# EAGLE design atcan (EAGLE 4.16)
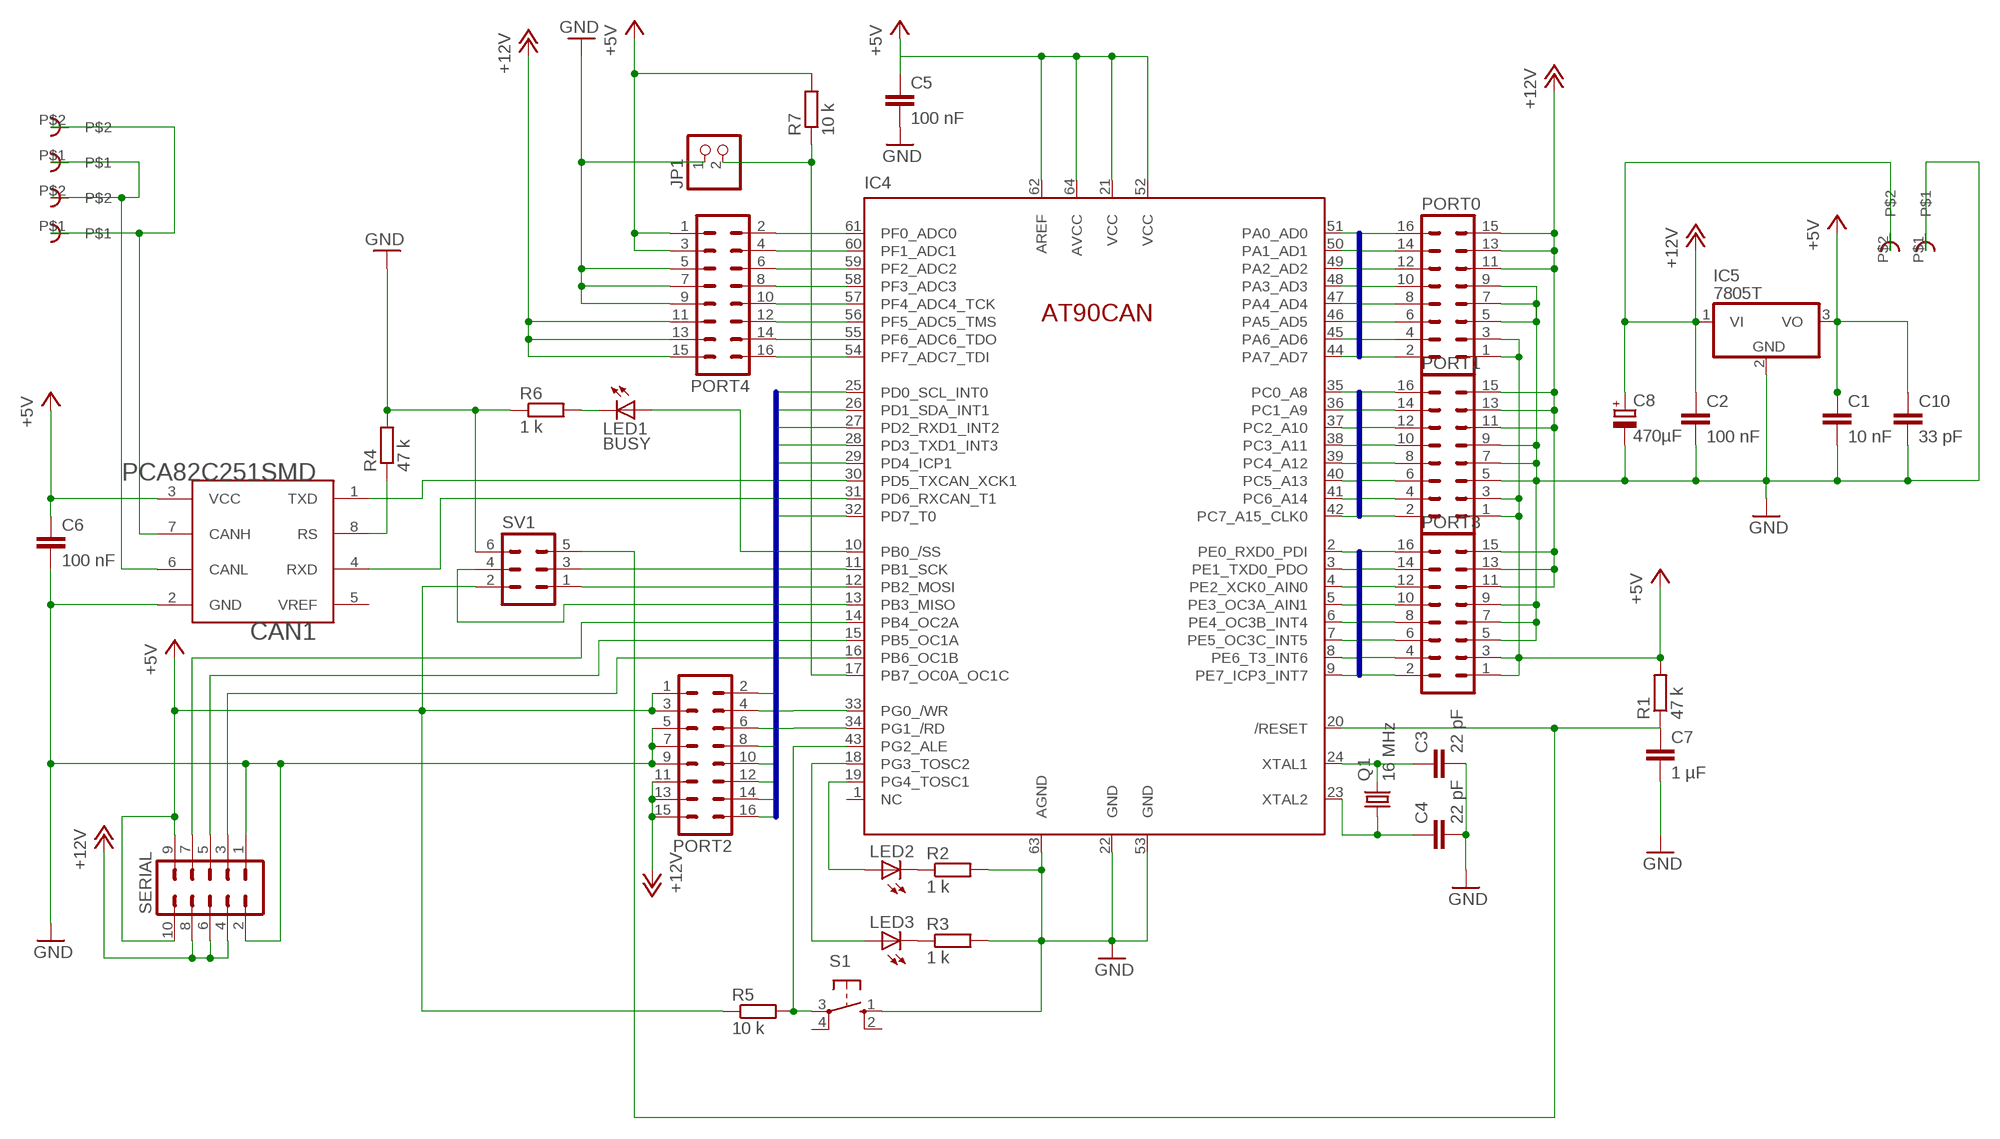
[diagram p0: schematic, sheet 1]

## Parts
C1  10 nF  C-EUC1206  [C1206]
C2  100 nF  C-EUC1206  [C1206]
C3  22 pF  C-EUC1206  [C1206]
C4  22 pF  C-EUC1206  [C1206]
C5  100 nF  C-EUC1206  [C1206]
C6  100 nF  C-EUC1206  [C1206]
C7  1 µF  C-EUC1206  [C1206]
C8  470µF  CPOL-EUR/2012-12R  [R/2012-12R]
C10  33 pF  C-EUC1206  [C1206]
CAN1  PCA82C251SMD  [SO8]
CAN-1  RIACON101-2  [RIACON101-2]
CAN-2  RIACON101-2  [RIACON101-2]
IC4  AT90CAN-TQFP  [TQFP64]
IC5  7805T  [TO220H]
JP1  PINHD-1X2  [1X02]
LED1  BUSY  LEDCHIPLED_1206  [CHIPLED_1206]
LED2  LEDCHIPLED_1206  [CHIPLED_1206]
LED3  LEDCHIPLED_1206  [CHIPLED_1206]
PORT0  ML16  [ML16]
PORT1  ML16  [ML16]
PORT2  ML16  [ML16]
PORT3  ML16  [ML16]
PORT4  ML16  [ML16]
POWER  RIACON101-2  [RIACON101-2]
Q1  16 MHz  CRYSTALSM49  [SM49]
R1  47 k  R-EU_M1206  [M1206]
R2  1 k  R-EU_M1206  [M1206]
R3  1 k  R-EU_M1206  [M1206]
R4  47 k  R-EU_M1206  [M1206]
R5  10 k  R-EU_M1206  [M1206]
R6  1 k  R-EU_M1206  [M1206]
R7  10 k  R-EU_M1206  [M1206]
S1  10-XX  [B3F-10XX]
SERIAL  ML10  [ML10]
SV1  ML6  [ML6]

## Nets
+5V: C1.1 C5.1 C6.1 C10.1 CAN1.3(VCC) IC4.21(VCC) IC4.52(VCC) IC4.62(AREF) IC4.64(AVCC) IC5.3(VO) PORT0.1 PORT0.3 PORT1.1 PORT1.3 PORT2.1 PORT2.3 PORT3.1 PORT3.3 PORT4.1 PORT4.3 R1.2 R5.1 R7.2 SERIAL.9 SERIAL.10 SV1.2
+12V: C2.1 C8.+ IC5.1(VI) PORT0.11 PORT0.13 PORT0.15 PORT1.11 PORT1.13 PORT1.15 PORT2.11 PORT2.13 PORT2.15 PORT3.11 PORT3.13 PORT3.15 PORT4.11 PORT4.13 PORT4.15 POWER.P$2 SERIAL.4 SERIAL.6 SERIAL.8
CANH: CAN1.6(CANL) CAN-1.P$1 CAN-2.P$2
CANL: CAN1.7(CANH) CAN-1.P$2 CAN-2.P$1
GND: C1.2 C2.2 C3.2 C4.2 C5.2 C6.2 C7.2 C8.- C10.2 CAN1.2(GND) IC4.22(GND) IC4.53(GND) IC4.63(AGND) IC5.2(GND) JP1.1 PORT0.5 PORT0.7 PORT0.9 PORT1.5 PORT1.7 PORT1.9 PORT2.5 PORT2.7 PORT2.9 PORT3.5 PORT3.7 PORT3.9 PORT4.5 PORT4.7 PORT4.9 POWER.P$1 R2.2 R3.2 R4.2 R6.1 S1.1(S) SERIAL.1 SERIAL.2 SV1.6
N$1: IC4.61(PF0_ADC0) PORT4.2
N$2: CAN1.8(RS) R4.1
N$3: IC4.12(PB2_MOSI) SV1.1
N$4: IC4.13(PB3_MISO) SV1.4
N$5: IC4.11(PB1_SCK) SV1.3
N$6: CAN1.4(RXD) IC4.31(PD6_RXCAN_T1)
N$7: CAN1.1(TXD) IC4.30(PD5_TXCAN_XCK1)
N$8: C3.1 IC4.24(XTAL1) Q1.2
N$9: IC4.14(PB4_OC2A) SERIAL.7
N$10: C4.1 IC4.23(XTAL2) Q1.1
N$11: IC4.15(PB5_OC1A) SERIAL.5
N$12: IC4.16(PB6_OC1B) SERIAL.3
N$13: IC4.60(PF1_ADC1) PORT4.4
N$14: IC4.59(PF2_ADC2) PORT4.6
N$15: IC4.58(PF3_ADC3) PORT4.8
N$16: IC4.57(PF4_ADC4_TCK) PORT4.10
N$17: IC4.56(PF5_ADC5_TMS) PORT4.12
N$18: IC4.55(PF6_ADC6_TDO) PORT4.14
N$19: IC4.54(PF7_ADC7_TDI) PORT4.16
N$20: LED1.C R6.2
N$21: IC4.10(PB0_/SS) LED1.A
N$22: LED2.C R2.1
N$23: LED3.C R3.1
N$24: IC4.19(PG4_TOSC1) LED2.A
N$25: IC4.18(PG3_TOSC2) LED3.A
N$26: IC4.43(PG2_ALE) R5.2 S1.3(P)
N$28: IC4.17(PB7_OC0A_OC1C) JP1.2 R7.1
PORTA0: IC4.51(PA0_AD0) PORT0.2
PORTA1: IC4.50(PA1_AD1) PORT0.4
PORTA2: IC4.49(PA2_AD2) PORT0.6
PORTA3: IC4.48(PA3_AD3) PORT0.8
PORTA4: IC4.47(PA4_AD4) PORT0.10
PORTA5: IC4.46(PA5_AD5) PORT0.12
PORTA6: IC4.45(PA6_AD6) PORT0.14
PORTA7: IC4.44(PA7_AD7) PORT0.16
PORTC0: IC4.35(PC0_A8) PORT1.2
PORTC1: IC4.36(PC1_A9) PORT1.4
PORTC2: IC4.37(PC2_A10) PORT1.6
PORTC3: IC4.38(PC3_A11) PORT1.8
PORTC4: IC4.39(PC4_A12) PORT1.10
PORTC5: IC4.40(PC5_A13) PORT1.12
PORTC6: IC4.41(PC6_A14) PORT1.14
PORTC7: IC4.42(PC7_A15_CLK0) PORT1.16
PORTD0: IC4.25(PD0_SCL_INT0) PORT2.16
PORTD1: IC4.26(PD1_SDA_INT1) PORT2.14
PORTD2: IC4.27(PD2_RXD1_INT2) PORT2.12
PORTD3: IC4.28(PD3_TXD1_INT3) PORT2.10
PORTD4: IC4.29(PD4_ICP1) PORT2.8
PORTD5: IC4.32(PD7_T0) PORT2.6
PORTD6: IC4.33(PG0_/WR) PORT2.4
PORTD7: IC4.34(PG1_/RD) PORT2.2
PORTE0: IC4.2(PE0_RXD0_PDI) PORT3.2
PORTE1: IC4.3(PE1_TXD0_PDO) PORT3.4
PORTE2: IC4.4(PE2_XCK0_AIN0) PORT3.6
PORTE3: IC4.5(PE3_OC3A_AIN1) PORT3.8
PORTE4: IC4.6(PE4_OC3B_INT4) PORT3.10
PORTE5: IC4.7(PE5_OC3C_INT5) PORT3.12
PORTE6: IC4.8(PE6_T3_INT6) PORT3.14
PORTE7: IC4.9(PE7_ICP3_INT7) PORT3.16
RESET: C7.1 IC4.20(/RESET) R1.1 SV1.5
Unconnected: CAN1.5(VREF) IC4.1(NC) S1.2(S1) S1.4(P1)

## Buses
PORTA[0..7]
PORTC[0..7]
PORTE[0..7]
PORTD[0..7]

## Library data of the parts
C1-C7 C10 = rcl:C-EU: CAPACITOR, European symbol
C8 = rcl:CPOL-EU: POLARIZED CAPACITOR, European symbol
CAN1 = 82C250SMD:PCA82C251SMD
CAN-1 CAN-2 POWER = con-riacon101-v2:RIACON101-2: Riaconn Schreaubklemme 101
IC4 = controller-micro_atmel_jd:AT90CAN
IC5 = linear:78*: Positive VOLTAGE REGULATOR Source: http://cache.national.com/ds/LM/LM78L05.pdf http://www.fairchildsemi.com/ds/LM/LM7805.pdf
JP1 = pinhead:PINHD-1X2: PIN HEADER
LED1-LED3 = led:LED: LED OSRAM: - CHIPLED LG R971, LG N971, LY N971, LG Q971, LY Q971, LO R971, LY R971 LH N974, LH R974 LS Q976, LO Q976, LY Q976 LO Q996 - Hyper CHIPLED LW Q18S LB Q993, LB Q99A, LB R99A - SideLED LS A670, LO A670, LY A670, LG A670, LP A670 LB A673, LV A673, LT A673, LW A673 LH A674 LY A675 LS A676, LA A676, LO A676, LY A676, LW A676 LS A679, LY A679, LG A679 - Hyper Micro SIDELED® LS Y876, LA Y876, LO Y876, LY Y876 LT Y87S - SmartLED LW L88C, LW L88S LB L89C, LB L89S, LG L890 LS L89K, LO L89K, LY L89K LS L896, LA L896, LO L896, LY L896 - TOPLED LS T670, LO T670, LY T670, LG T670, LP T670 LSG T670, LSP T670, LSY T670, LOP T670, LYG T670 LG T671, LOG T671, LSG T671 LB T673, LV T673, LT T673, LW T673 LH T674 LS T676, LA T676, LO T676, LY T676, LB T676, LH T676, LSB T676, LW T676 LB T67C, LV T67C, LT T67C, LS T67K, LO T67K, LY T67K, LW E67C LS E67B, LA E67B, LO E67B, LY E67B, LB E67C, LV E67C, LT E67C LW T67C LS T679, LY T679, LG T679 LS T770, LO T770, LY T770, LG T770, LP T770 LB T773, LV T773, LT T773, LW T773 LH T774 LS E675, LA E675, LY E675, LS T675 LS T776, LA T776, LO T776, LY T776, LB T776 LHGB T686 LT T68C, LB T68C - Hyper Mini TOPLED® LB M676 - Mini TOPLED Santana® LG M470 LS M47K, LO M47K, LY M47K Source: http://www.osram.convergy.de - LUMILED® LXK2-PW12-R00, LXK2-PW12-S00, LXK2-PW14-U00, LXK2-PW14-V00 LXK2-PM12-R00, LXK2-PM12-S00, LXK2-PM14-U00 LXK2-PE12-Q00, LXK2-PE12-R00, LXK2-PE12-S00, LXK2-PE14-T00, LXK2-PE14-U00 LXK2-PB12-K00, LXK2-PB12-L00, LXK2-PB12-M00, LXK2-PB14-N00, LXK2-PB14-P00, LXK2-PB14-Q00 LXK2-PR12-L00, LXK2-PR12-M00, LXK2-PR14-Q00, LXK2-PR14-R00 LXK2-PD12-Q00, LXK2-PD12-R00, LXK2-PD12-S00 LXK2-PH12-R00, LXK2-PH12-S00 LXK2-PL12-P00, LXK2-PL12-Q00, LXK2-PL12-R00 Source: www.luxeon.com
PORT0 PORT1-PORT4 = con-harting-ml:ML16: HARTING
Q1 = crystal:CRYSTAL: CRYSTAL
R1-R7 = rcl:R-EU_: RESISTOR, European symbol
S1 = switch-omron:10-XX: OMRON SWITCH
SERIAL = con-harting-ml:ML10: HARTING
SV1 = con-harting-ml:ML6: HARTING

## Board
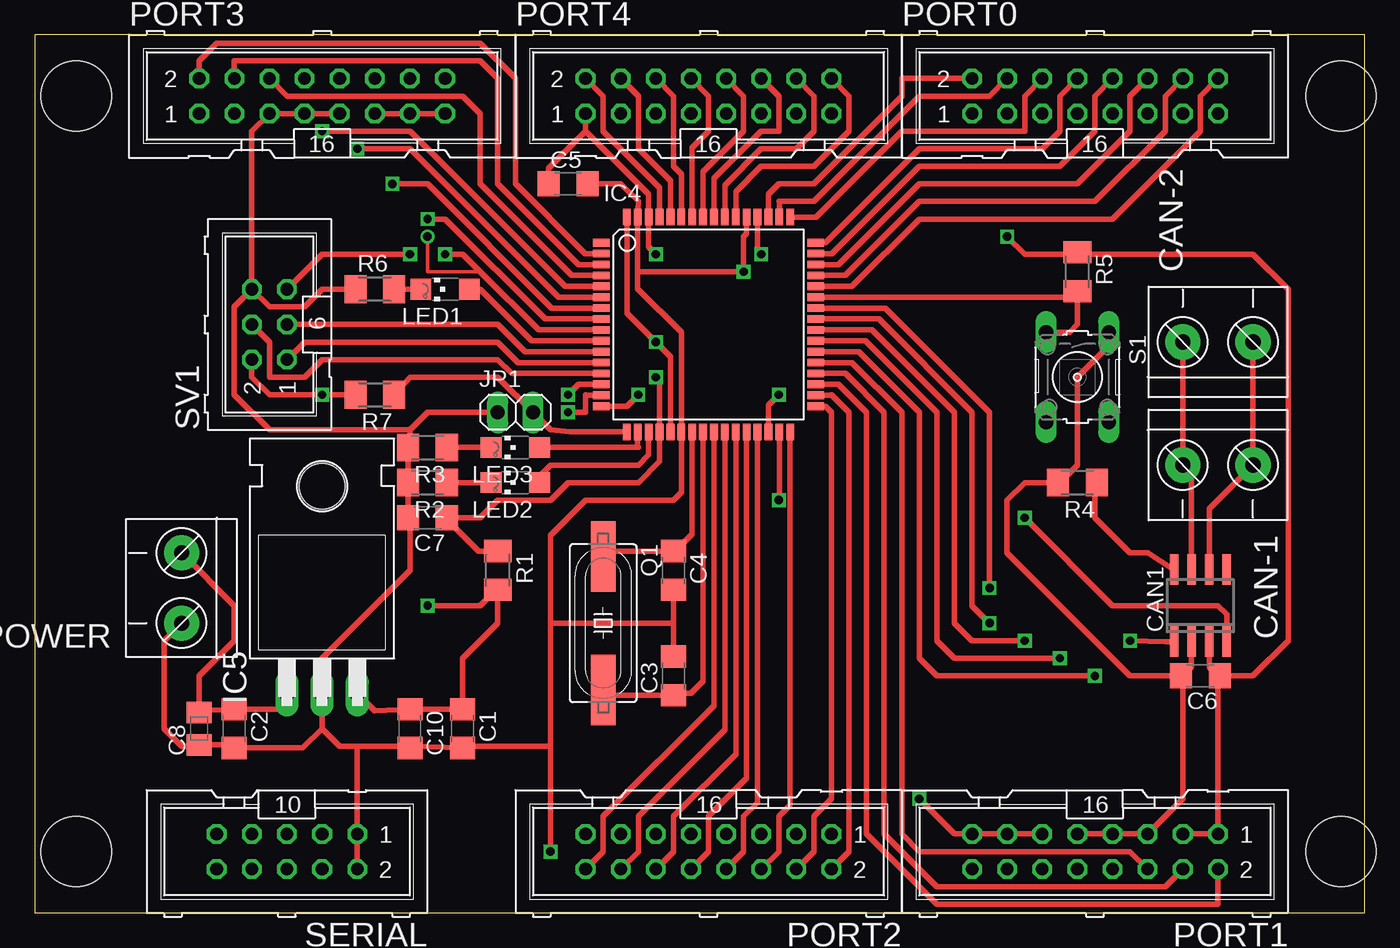
[diagram p1: board, top side]
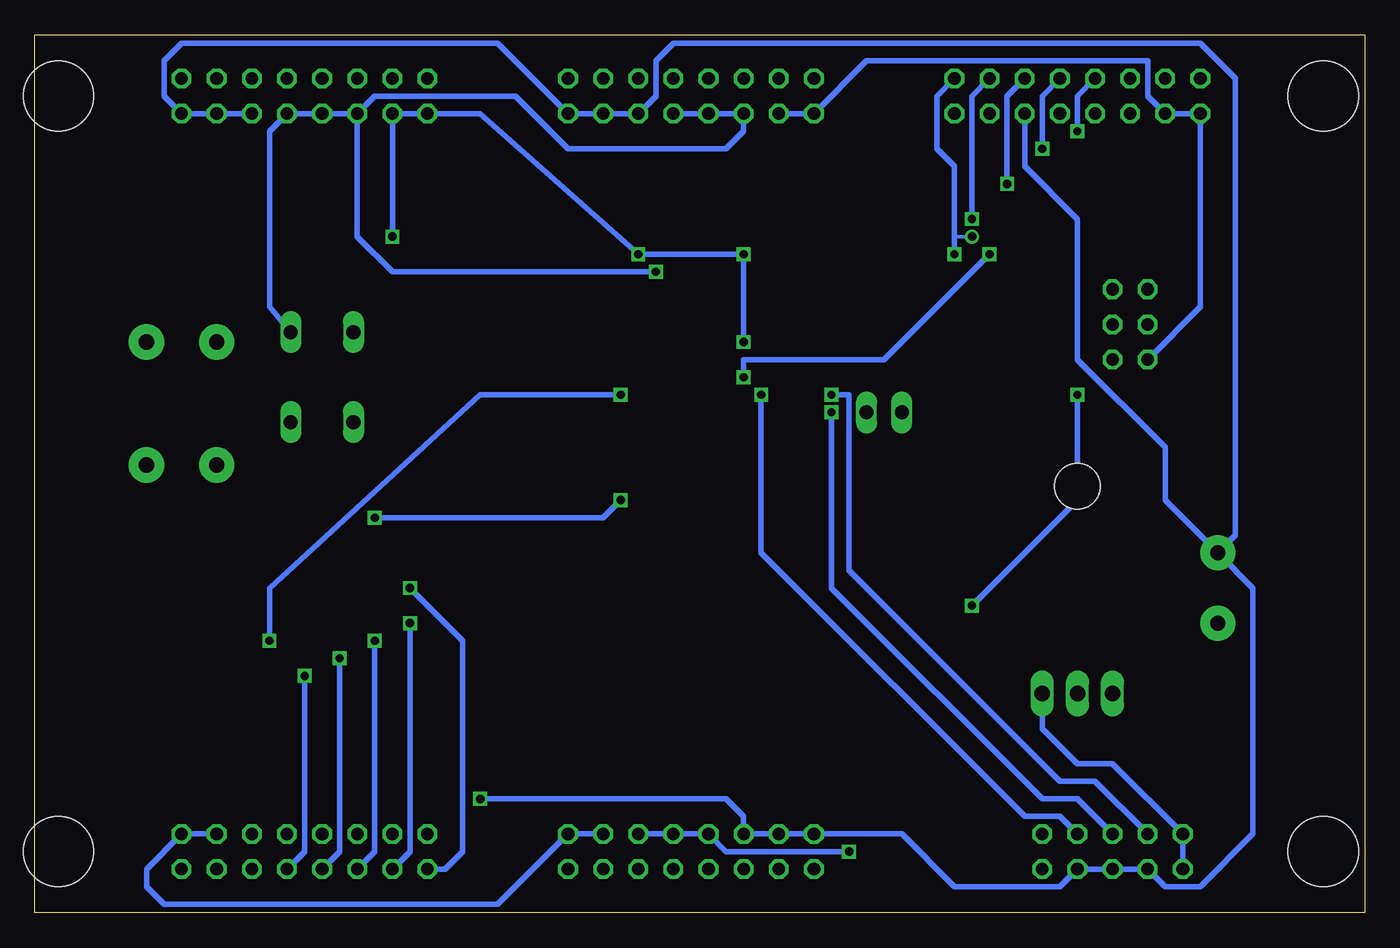
[diagram p2: board, bottom side, seen from below]

Size 96.19 x 63.49 mm. Coordinates in mm from the lower left corner, seen from the top.
Outline: 0,0 96.19,0 96.19,63.49 0,63.49 0,0
Copper layers (1*16): Top 0.035mm / dielectric 1.5mm / Bottom 0.035mm
Design rules "default": minimum track width 10mil, minimum drill 24mil, track to track 8mil, track to pad 8mil, pad to pad 8mil, via to via 8mil, smd to smd 8mil, copper to edge 40mil, drill to drill 8mil, minimum pad ring 10mil, minimum via ring 8mil, stop-mask expansion 4mil, vias tented up to drill 0mil, thermal gap 10mil
Holes 5.08 mm at 3.01,59.05 3.01,4.44 94.45,4.44 94.45,59.05

### Footprints (pad centres in the part's own frame; a part is rotated, then mirrored left to right if it is on the bottom)
C1206 = smd 1.6 x 1.8: 1 -1.4,0; 2 1.4,0
R/2012-12R = smd 1.55 x 1.8: + 1.175,0; - -1.175,0
SO8 = smd 0.6 x 2.2: 1 -1.905,-2.6; 2 -0.635,-2.6; 3 0.635,-2.6; 4 1.905,-2.6; 5 1.905,2.6; 6 0.635,2.6; 7 -0.635,2.6; 8 -1.905,2.6
RIACON101-2 = drill 1.1 pad 2.54 round: P$1 0,2.54; P$2 0,-2.54
TQFP64 = smd 1.194 x 0.559: 1 -7.76,5.905; 2 -7.76,5.118; 3 -7.76,4.331; 4 -7.76,3.543; 5 -7.76,2.756; 6 -7.76,1.968; 7 -7.76,1.181; 8 -7.76,0.394; 9 -7.76,-0.394; 10 -7.76,-1.181; 11 -7.76,-1.968; 12 -7.76,-2.756; 13 -7.76,-3.543; 14 -7.76,-4.331; 15 -7.76,-5.118; 16 -7.76,-5.905; 33 7.76,-5.905; 34 7.76,-5.118; 35 7.76,-4.331; 36 7.76,-3.543; 37 7.76,-2.756; 38 7.76,-1.968; 39 7.76,-1.181; 40 7.76,-0.394; 41 7.76,0.394; 42 7.76,1.181; 43 7.76,1.968; 44 7.76,2.756; 45 7.76,3.543; 46 7.76,4.331; 47 7.76,5.118; 48 7.76,5.905 | smd 0.559 x 1.194: 17 -5.905,-7.76; 18 -5.118,-7.76; 19 -4.331,-7.76; 20 -3.543,-7.76; 21 -2.756,-7.76; 22 -1.968,-7.76; 23 -1.181,-7.76; 24 -0.394,-7.76; 25 0.394,-7.76; 26 1.181,-7.76; 27 1.968,-7.76; 28 2.756,-7.76; 29 3.543,-7.76; 30 4.331,-7.76; 31 5.118,-7.76; 32 5.905,-7.76; 49 5.905,7.76; 50 5.118,7.76; 51 4.331,7.76; 52 3.543,7.76; 53 2.756,7.76; 54 1.968,7.76; 55 1.181,7.76; 56 0.394,7.76; 57 -0.394,7.76; 58 -1.181,7.76; 59 -1.968,7.76; 60 -2.756,7.76; 61 -3.543,7.76; 62 -4.331,7.76; 63 -5.118,7.76; 64 -5.905,7.76
TO220H = drill 1.118 long: 1 -2.54,-10.16; 2 0,-10.16; 3 2.54,-10.16 | hole 3.302: 0,4.826
1X02 = drill 1.016 long: 1 -1.27,0; 2 1.27,0
CHIPLED_1206 = smd 1.5 x 1.5: A 0,-1.75; C 0,1.75
ML16 = drill 0.914 octagon: 1 -8.89,-1.27; 2 -8.89,1.27; 3 -6.35,-1.27; 4 -6.35,1.27; 5 -3.81,-1.27; 6 -3.81,1.27; 7 -1.27,-1.27; 8 -1.27,1.27; 9 1.27,-1.27; 10 1.27,1.27; 11 3.81,-1.27; 12 3.81,1.27; 13 6.35,-1.27; 14 6.35,1.27; 15 8.89,-1.27; 16 8.89,1.27
SM49 = smd 5.08 x 1.778: 1 -4.826,0; 2 4.826,0
M1206 = smd 1.6 x 2: 1 -1.4,0; 2 1.4,0
B3F-10XX = drill 1.016 long: 1 -3.251,2.261; 2 3.251,2.261; 3 -3.251,-2.261; 4 3.251,-2.261
ML10 = drill 0.914 octagon: 1 -5.08,-1.27; 2 -5.08,1.27; 3 -2.54,-1.27; 4 -2.54,1.27; 5 0,-1.27; 6 0,1.27; 7 2.54,-1.27; 8 2.54,1.27; 9 5.08,-1.27; 10 5.08,1.27
ML6 = drill 0.914 octagon: 1 -2.54,-1.27; 2 -2.54,1.27; 3 0,-1.27; 4 0,1.27; 5 2.54,-1.27; 6 2.54,1.27

### Placement (x,y rotation side)
C1  30.95,13.33 270 top
C2  14.44,13.33 270 top
C3  46.19,17.14 90 top
C4  46.19,24.76 270 top
C5  38.57,52.7 0 top
C6  84.29,17.14 180 top
C7  28.41,28.57 180 top
C8  11.9,13.33 90 top
C10  27.14,13.33 270 top
CAN1  84.29,22.22 0 top
CAN-1  85.56,32.38 270 top
CAN-2  85.56,41.27 90 top
IC4  48.73,42.54 0 top
IC5  20.79,26.03 0 top
JP1  34.76,36.19 0 top
LED1  29.68,45.08 90 top
LED2  34.76,31.11 90 top
LED3  34.76,33.65 90 top
PORT0  76.67,59.05 0 top
PORT1  76.67,4.44 180 top
PORT2  48.73,4.44 180 top
PORT3  20.79,59.05 0 top
PORT4  48.73,59.05 0 top
POWER  10.63,23.49 180 top
Q1  41.11,20.95 270 top
R1  33.49,24.76 270 top
R2  28.41,31.11 180 top
R3  28.41,33.65 180 top
R4  75.4,31.11 180 top
R5  75.4,46.35 270 top
R6  24.6,45.08 0 top
R7  24.6,37.46 180 top
S1  75.4,38.73 270 top
SERIAL  18.25,4.44 180 top
SV1  16.98,42.54 90 top

### Tracks (layer width: path | path; a pad name or v marks a point on that pad's centre or on a via)
+5V  (via drill 0.6)
  Top 0.406: 39.84,56.51 44.4,51.95 IC4.62 44.4,48.14 v44.92,47.62 | PORT4.1 39.84,56.51 | C5.1 37.17,53.84 39.84,56.51 | SV1.2 15.71,38.73 16.98,37.46 v20.79,37.46 R7.2 23.33,37.33 | CAN1.3 84.92,17.77 85.56,17.14 | 85.56,17.14 PORT1.1 PORT1.3 | 30.95,14.6 30.82,14.73 C10.1 24.6,14.6 IC5.3 | 85.56,17.14 C6.1 | 85.56,17.14 88.1,17.14 90.64,19.68 90.64,45.08 88.1,47.62 75.4,47.62 R5.1 75.27,47.62 71.59,47.62 v70.32,48.89 | IC4.52 52.27,47.89 v52.54,47.62 | IC4.21 45.97,40.22 v44.92,41.27 42.82,43.36 IC4.64 | 30.95,14.6 C1.1 | 30.95,14.6 30.95,18.41 33.49,20.95 R1.2 33.49,23.49 32.22,22.22 v28.41,22.22
  Bottom 0.406: SV1.2 11.9,43.81 PORT3.1 PORT3.3 15.71,59.05 15.71,61.59 36.03,61.59 PORT4.1 PORT4.3 | PORT1.3 PORT1.1 88.1,3.17 88.1,1.9 86.83,0.63 62.7,0.63 PORT2.1 PORT2.3 | IC5.3 23.33,13.33 20.79,10.79 18.25,10.79 SERIAL.9 SERIAL.10 | v44.92,41.27 v44.92,47.62 v52.54,47.62 63.97,57.78 PORT0.1 PORT0.3 v70.32,48.89 | v28.41,22.22 20.79,29.84 v20.79,37.46
+12V  (via drill 0.6)
  Top 0.406: PORT1.11 PORT1.13 PORT1.15 66.51,5.71 v63.97,8.25 | IC5.1 18.25,14.6 18.12,14.73 C2.1 11.9,14.6 C8.+ 11.9,17.14 14.44,19.68 14.44,22.22 POWER.P$2 | PORT3.11 PORT3.13 PORT3.15
  Bottom 0.406: PORT0.15 PORT0.13 PORT0.11 PORT0.15 | PORT0.15 86.83,59.05 86.83,61.59 85.56,62.86 62.7,62.86 PORT4.15 PORT4.13 PORT4.11 51.27,59.05 51.27,61.59 50,62.86 11.9,62.86 9.36,60.32 9.36,27.3 POWER.P$2 | POWER.P$2 8.09,23.49 8.09,5.71 11.9,1.9 14.44,1.9 SERIAL.8 SERIAL.6 SERIAL.4 22.06,1.9 29.68,1.9 33.49,5.71 PORT2.15 PORT2.13 PORT2.11 44.92,6.98 46.19,8.25 v63.97,8.25 | POWER.P$2 14.44,29.84 14.44,33.65 20.79,40 20.79,50.16 24.6,53.97 PORT3.11
CANH
  Top 0.406: CAN-2.P$2 CAN-1.P$1 84.92,29.2 CAN1.6
CANL
  Top 0.406: CAN-2.P$1 CAN-1.P$2 83.66,31.74 CAN1.7
GND  (via drill 0.6)
  Top 0.406: 43.61,46.35 43.61,45.12 46.76,41.97 IC4.22 46.76,30.41 46.19,29.84 39.84,29.84 37.3,27.3 37.3,20.95 | 43.61,46.35 IC4.63 43.65,51.43 42.38,52.7 C5.2 39.84,52.7 | IC4.53 51.49,49.11 51.27,48.89 v51.27,46.35 43.61,46.35 | 27.14,33.65 27.01,33.52 R2.2 27.01,28.7 27.14,28.57 | JP1.1 28.41,36.19 27.14,34.92 | 27.14,33.65 R3.2 | 27.14,33.65 27.14,34.92 | R6.1 20.79,45.08 19.52,43.81 16.98,43.81 SV1.6 | 37.3,20.95 46.19,20.95 | 46.19,23.49 C4.2 46.19,20.95 | 46.19,18.41 C3.2 46.19,20.95 | SV1.6 14.44,43.81 14.44,37.46 16.98,34.92 27.14,34.92 | 27.14,28.57 C7.2 | PORT3.9 PORT3.7 PORT3.5 15.71,56.51 SV1.6 | CAN1.2 83.66,17.77 83.02,17.14 | 83.02,17.14 82.89,17.27 C6.2 83.02,17.14 | 83.02,17.14 83.02,8.25 PORT1.5 PORT1.7 PORT1.9 | 83.02,17.14 79.21,17.14 70.32,26.03 70.32,29.84 71.59,31.11 R4.2 74.13,31.11 75.4,32.38 75.4,38.73 77.66,40.99 S1.1 | 20.79,13.33 19.39,11.93 C2.2 14.44,12.06 14.34,12.15 C8.- 11.9,12.06 10.63,12.06 9.36,13.33 9.36,19.68 POWER.P$1 | 20.79,13.33 IC5.2 20.79,18.41 27.14,24.76 27.14,28.57 | 27.14,12.06 C1.2 30.95,12.06 37.3,12.06 | 27.14,12.06 C10.2 | 23.33,12.06 22.06,12.06 20.79,13.33 | 23.33,12.06 27.14,12.06 | SERIAL.2 SERIAL.1 23.33,12.06 | 37.3,12.06 37.3,20.95 | 37.3,12.06 v37.3,4.44
  Bottom 0.406: PORT0.5 PORT0.7 PORT0.9 79.21,56.51 79.21,43.81 S1.1 | PORT0.5 72.86,48.89 70.32,46.35 v51.27,46.35 | PORT4.9 PORT4.7 PORT4.5 44.92,56.51 46.19,55.24 57.62,55.24 61.43,59.05 71.59,59.05 PORT0.5 | PORT2.5 PORT2.7 PORT2.9 46.19,4.44 v37.3,4.44
N$1
  Top 0.406: IC4.61 45.19,52.43 41.11,56.51 41.11,59.05 PORT4.2
N$2
  Top 0.406: CAN1.8 80.48,26.03 79.21,26.03 76.67,28.57 76.67,31.11 R4.1
N$3
  Top 0.406: IC4.12 34.98,39.78 33.49,41.27 19.52,41.27 SV1.1
N$4
  Top 0.406: IC4.13 34.49,39 33.49,40 20.79,40 19.52,38.73 16.98,38.73 16.98,41.27 SV1.4
N$5
  Top 0.406: IC4.11 35.46,40.57 33.49,42.54 SV1.3
N$6  (via drill 0.6)
  Top 0.406: IC4.31 53.85,29.88 v53.81,29.84 | CAN1.4 86.19,21.59 85.56,22.22 77.94,22.22 v71.59,28.57
  Bottom 0.406: v71.59,28.57 55.08,28.57 v53.81,29.84
N$7  (via drill 0.6)
  Top 0.406: IC4.30 53.06,36.71 v53.81,37.46 | CAN1.1 81.81,19.62 v79.21,19.68
  Bottom 0.406: v79.21,19.68 79.21,23.49 63.97,37.46 v53.81,37.46
N$8
  Top 0.406: IC4.24 48.34,16.75 47.46,15.87 46.19,15.87 C3.1 41.24,15.74 41.11,15.87 Q1.2
N$9  (via drill 0.6)
  Top 0.406: IC4.14 39.32,38.21 v38.57,37.46
  Bottom 0.406: SERIAL.7 19.52,9.52 22.06,9.52 37.3,24.76 37.3,37.46 v38.57,37.46
N$10
  Top 0.406: IC4.23 47.55,27.39 46.19,26.03 C4.1 41.24,26.16 41.11,26.03 Q1.1
N$11  (via drill 0.6)
  Top 0.406: IC4.15 39.88,37.42 39.84,37.46 39.84,36.19 v38.57,36.19
  Bottom 0.406: SERIAL.5 20.79,8.25 23.33,8.25 38.57,23.49 v38.57,36.19
N$12  (via drill 0.6)
  Top 0.406: IC4.16 42.82,36.63 v43.65,37.46
  Bottom 0.406: SERIAL.3 22.06,6.98 24.6,6.98 43.65,26.03 v43.65,37.46
N$13
  Top 0.406: IC4.60 45.97,52.92 43.65,55.24 43.65,59.05 PORT4.4
N$14
  Top 0.406: IC4.59 46.76,53.4 46.19,53.97 46.19,59.05 PORT4.6
N$15
  Top 0.406: IC4.58 47.55,55.33 48.73,56.51 48.73,59.05 PORT4.8
N$16
  Top 0.406: IC4.57 48.34,53.58 51.27,56.51 51.27,59.05 PORT4.10
N$17
  Top 0.406: IC4.56 49.12,53.09 52.54,56.51 53.81,56.51 53.81,59.05 PORT4.12
N$18
  Top 0.406: IC4.55 49.91,52.61 52.54,55.24 55.08,55.24 56.35,56.51 56.35,59.05 PORT4.14
N$19
  Top 0.406: IC4.54 50.7,52.13 52.54,53.97 56.35,53.97 58.89,56.51 58.89,59.05 PORT4.16
N$20
  Top 0.406: 28.41,45.08 LED1.C R6.2
N$21
  Top 0.406: LED1.A 32.22,45.08 35.94,41.36 IC4.10
N$22
  Top 0.406: 33.49,31.11 LED2.C R2.1
N$23
  Top 0.406: 33.49,33.65 LED3.C R3.1
N$24
  Top 0.406: IC4.19 44.4,33.13 43.65,32.38 37.3,32.38 36.03,31.11 LED2.A
N$25
  Top 0.406: IC4.18 43.61,33.69 43.65,33.65 LED3.A 36.03,33.65
N$26
  Top 0.406: IC4.43 74.83,44.51 75.4,45.08 | S1.3 74.84,41.98 75.4,42.54 75.4,45.08 | 75.4,45.08 R5.2
N$28
  Top 0.406: IC4.17 38.71,34.78 37.3,34.92 JP1.2 33.49,38.73 27.14,38.73 R7.1
N$35  (via drill 0.6)
  other vias: 29.68,47.62
PORTA0
  Top 0.406: PORT0.2 62.7,60.32 62.7,59.05 56.35,52.7 53.81,52.7 53.06,51.95 IC4.51
PORTA1
  Top 0.406: PORT0.4 69.05,59.05 63.97,59.05 56.35,51.43 53.81,51.43 53.85,51.39 IC4.50
PORTA2
  Top 0.406: PORT0.6 71.59,59.05 71.59,56.51 62.7,56.51 56.49,50.3 IC4.49
PORTA3
  Top 0.406: IC4.48 57.18,48.45 63.97,55.24 72.86,55.24 74.13,56.51 74.13,59.05 PORT0.8
PORTA4
  Top 0.406: PORT0.10 76.67,59.05 76.67,56.51 74.13,53.97 63.97,53.97 57.66,47.66 IC4.47
PORTA5
  Top 0.406: IC4.46 58.14,46.87 63.97,52.7 75.4,52.7 79.21,56.51 79.21,59.05 PORT0.12
PORTA6
  Top 0.406: IC4.45 58.62,46.08 63.97,51.43 76.67,51.43 81.75,56.51 81.75,59.05 PORT0.14
PORTA7
  Top 0.406: IC4.44 59.11,45.3 63.97,50.16 77.94,50.16 84.29,56.51 84.29,59.05 PORT0.16
PORTC0
  Top 0.406: IC4.35 58.14,38.21 60.16,36.19 60.16,5.71 65.24,0.63 85.56,0.63 PORT1.2
PORTC1
  Top 0.406: IC4.36 58.62,39 61.43,36.19 61.43,5.71 65.24,1.9 81.75,1.9 PORT1.4
PORTC2
  Top 0.406: IC4.37 59.11,39.78 62.7,36.19 62.7,5.71 63.97,4.44 79.21,4.44 PORT1.6
PORTC3  (via drill 0.6)
  Top 0.406: IC4.38 59.59,40.57 63.97,36.19 63.97,18.41 65.24,17.14 v76.67,17.14
  Bottom 0.406: PORT1.8 76.67,4.44 v76.67,17.14
PORTC4  (via drill 0.6)
  Top 0.406: IC4.39 60.07,41.36 65.24,36.19 65.24,19.68 66.51,18.41 v74.13,18.41
  Bottom 0.406: PORT1.10 74.13,4.44 v74.13,18.41
PORTC5  (via drill 0.6)
  Top 0.406: IC4.40 60.55,42.15 66.51,36.19 66.51,20.95 67.78,19.68 v71.59,19.68
  Bottom 0.406: PORT1.12 71.59,4.44 v71.59,19.68
PORTC6  (via drill 0.6)
  Top 0.406: IC4.41 61.04,42.93 67.78,36.19 67.78,22.22 v69.05,20.95
  Bottom 0.406: PORT1.14 69.05,4.44 v69.05,20.95
PORTC7  (via drill 0.6)
  Top 0.406: IC4.42 61.52,43.72 69.05,36.19 v69.05,23.49
  Bottom 0.406: PORT1.16 66.51,3.17 65.24,4.44 65.24,19.68 v69.05,23.49
PORTD0
  Top 0.406: IC4.25 49.12,14.99 41.11,6.98 41.11,4.44 PORT2.16
PORTD1
  Top 0.406: IC4.26 49.91,13.24 43.65,6.98 43.65,4.44 PORT2.14
PORTD2
  Top 0.406: IC4.27 50.7,11.49 46.19,6.98 46.19,4.44 PORT2.12
PORTD3
  Top 0.406: IC4.28 51.49,9.74 48.73,6.98 48.73,4.44 PORT2.10
PORTD4
  Top 0.406: IC4.29 52.27,7.98 51.27,6.98 51.27,4.44 PORT2.8
PORTD5
  Top 0.406: IC4.32 54.64,7.81 53.81,6.98 53.81,4.44 PORT2.6
PORTD6
  Top 0.406: IC4.33 57.18,36.63 57.62,36.19 57.62,8.25 56.35,6.98 56.35,4.44 PORT2.4
PORTD7
  Top 0.406: IC4.34 57.58,37.42 57.62,37.46 58.89,36.19 58.89,4.44 PORT2.2
PORTE0
  Top 0.406: IC4.2 39.8,47.66 34.76,52.7 34.76,60.32 32.22,62.86 13.17,62.86 11.9,61.59 PORT3.2
PORTE1
  Top 0.406: IC4.3 39.32,46.87 33.49,52.7 33.49,60.32 32.22,61.59 14.44,61.59 PORT3.4
PORTE2
  Top 0.406: IC4.4 38.84,46.08 32.22,52.7 32.22,57.78 30.95,59.05 18.25,59.05 PORT3.6
PORTE3  (via drill 0.6)
  Top 0.406: IC4.5 38.35,45.3 27.14,56.51 v20.79,56.51
  Bottom 0.406: PORT3.8 20.79,59.05 v20.79,56.51
PORTE4  (via drill 0.6)
  Top 0.406: IC4.6 37.87,44.51 27.14,55.24 v23.33,55.24
  Bottom 0.406: PORT3.10 23.33,59.05 v23.33,55.24
PORTE5  (via drill 0.6)
  Top 0.406: IC4.7 37.39,43.72 28.41,52.7 v25.87,52.7
  Bottom 0.406: PORT3.12 25.87,59.05 v25.87,52.7
PORTE6  (via drill 0.6)
  Top 0.406: IC4.8 36.91,42.93 29.68,50.16 v28.41,50.16
  Bottom 0.406: PORT3.14 28.41,59.05 v28.41,50.16
PORTE7  (via drill 0.61)
  Top 0.254: 32.22,46.35 28.41,46.35 v28.41,48.89
  Top 0.406: IC4.9 36.42,42.15 32.22,46.35 30.95,47.62 29.68,47.62
  Bottom 0.254: v28.41,48.89 29.68,48.89
  Bottom 0.406: PORT3.16 30.95,59.05 30.95,55.24 29.68,53.97 29.68,48.89 29.68,47.62
RESET  (via drill 0.6)
  Top 0.406: R1.1 32.09,26.16 29.68,28.57 C7.1 32.22,28.57 33.49,29.84 37.3,29.84 38.57,31.11 43.65,31.11 45.19,32.65 IC4.20 45.19,38.46 v44.92,38.73 | SV1.5 20.79,47.62 v27.14,47.62
  Bottom 0.406: v44.92,38.73 44.92,40 34.76,40 v27.14,47.62